# Altium project Guppy Buddy Rev B.PrjPCB (part 9 of 9)

## Sheet FPGA Cart.SchDoc: Cart
size Tabloid; ApprovedBy: NA; CompanyName: Cospan Design LLC; DrawnBy: David McCoy; Engineer: David McCoy; DocumentNumber: 12; Revision: A; SheetNumber: 12; SheetTotal: 18; Client: OSH; Project: Guppy Buddy; ProjectPrettyName: Guppy Buddy
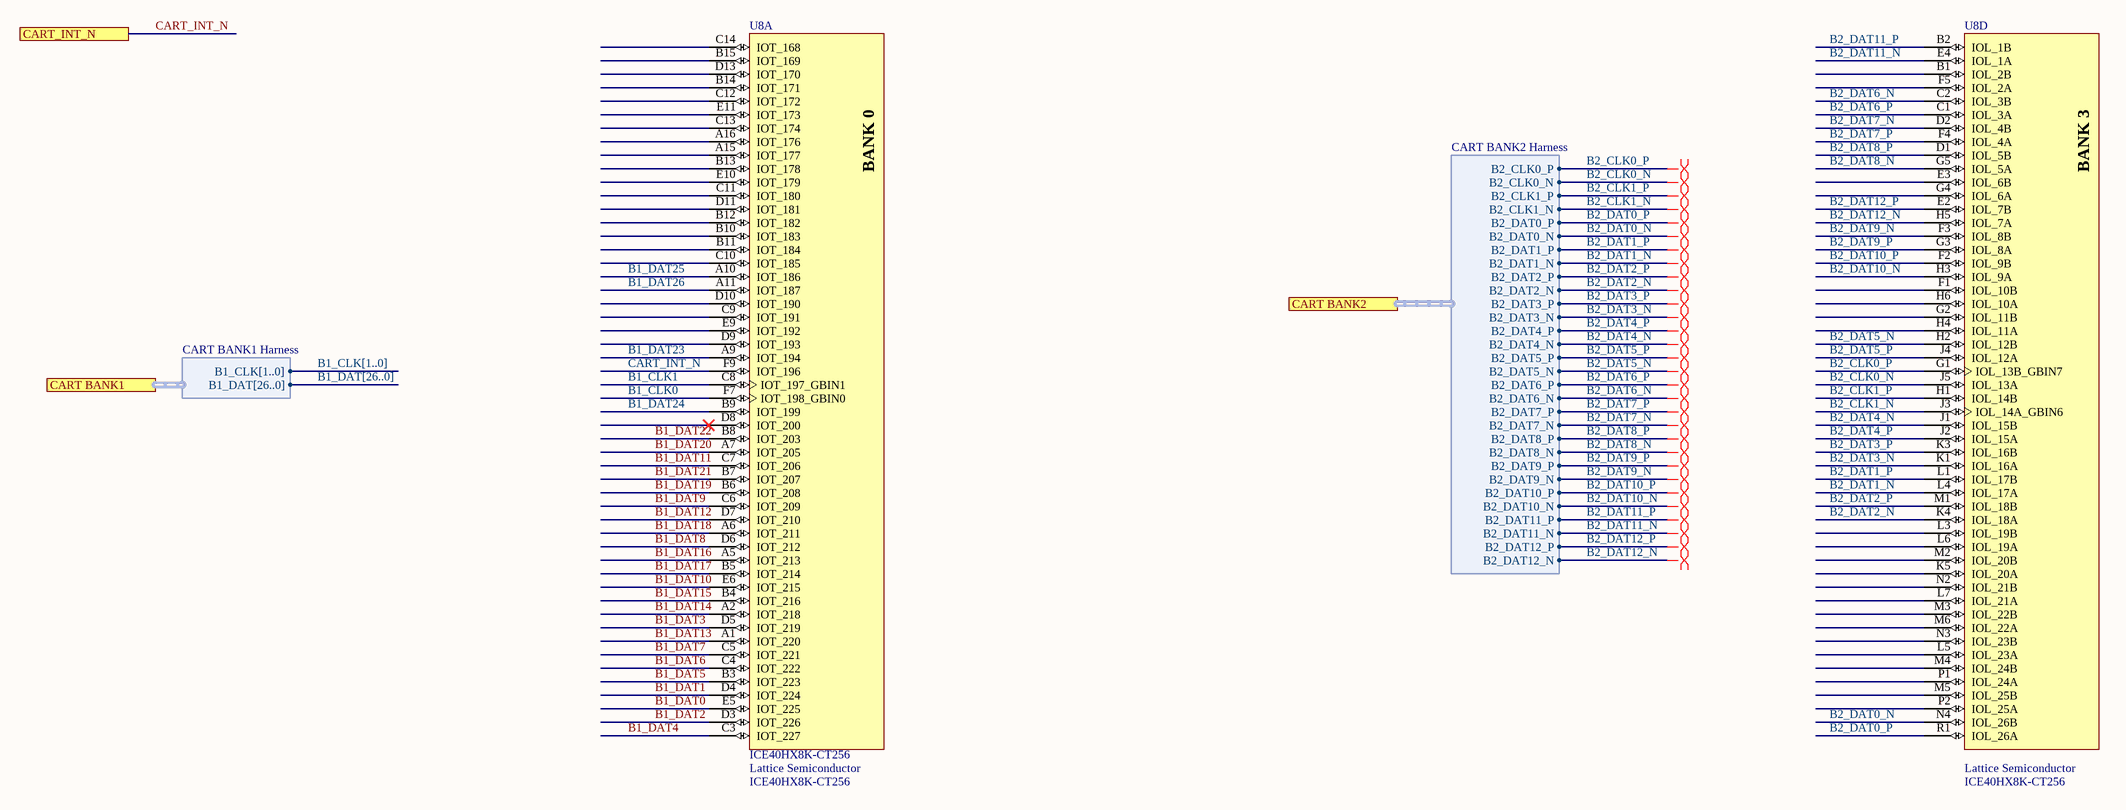
[diagram p17: FPGA Cart.SchDoc]

### Parts
U8  ICE40HX8K-CT256  Manufacturer 1: Lattice Semiconductor  [LATC-caBGA-256]  (parts A,D of 5)

### Ports
CART BANK1 (harness CART BANK1 Harness), CART BANK2 (harness CART BANK2 Harness), CART_INT_N

### Harnesses
CART BANK2 Harness: B2_CLK0_P, B2_CLK0_N, B2_CLK1_P, B2_CLK1_N, B2_DAT0_P, B2_DAT0_N, B2_DAT1_P, B2_DAT1_N, B2_DAT2_P, B2_DAT2_N, B2_DAT3_P, B2_DAT3_N, B2_DAT4_P, B2_DAT4_N, B2_DAT5_P, B2_DAT5_N, B2_DAT6_P, B2_DAT6_N, B2_DAT7_P, B2_DAT7_N, B2_DAT8_P, B2_DAT8_N, B2_DAT9_P, B2_DAT9_N, B2_DAT10_P, B2_DAT10_N, B2_DAT11_P, B2_DAT11_N, B2_DAT12_P, B2_DAT12_N
CART BANK1 Harness: B1_CLK[1..0], B1_DAT[26..0]

### Nets
B1_CLK0: U8.F7(IOT_198_GBIN0)
B1_CLK1: U8.C8(IOT_197_GBIN1)
B1_DAT0: U8.E5(IOT_225)
B1_DAT1: U8.D4(IOT_224)
B1_DAT2: U8.D3(IOT_226)
B1_DAT3: U8.D5(IOT_219)
B1_DAT4: U8.C3(IOT_227)
B1_DAT5: U8.B3(IOT_223)
B1_DAT6: U8.C4(IOT_222)
B1_DAT7: U8.C5(IOT_221)
B1_DAT8: U8.D6(IOT_212)
B1_DAT9: U8.C6(IOT_209)
B1_DAT10: U8.E6(IOT_215)
B1_DAT11: U8.C7(IOT_206)
B1_DAT12: U8.D7(IOT_210)
B1_DAT13: U8.A1(IOT_220)
B1_DAT14: U8.A2(IOT_218)
B1_DAT15: U8.B4(IOT_216)
B1_DAT16: U8.A5(IOT_213)
B1_DAT17: U8.B5(IOT_214)
B1_DAT18: U8.A6(IOT_211)
B1_DAT19: U8.B6(IOT_208)
B1_DAT20: U8.A7(IOT_205)
B1_DAT21: U8.B7(IOT_207)
B1_DAT22: U8.B8(IOT_203)
B1_DAT23: U8.A9(IOT_194)
B1_DAT24: U8.B9(IOT_199)
B1_DAT25: U8.A10(IOT_186)
B1_DAT26: U8.A11(IOT_187)
B2_CLK0_N: U8.J5(IOL_13A) ; port CART BANK2.B2_CLK0_N
B2_CLK0_P: U8.G1(IOL_13B_GBIN7) ; port CART BANK2.B2_CLK0_P
B2_CLK1_N: U8.J3(IOL_14A_GBIN6) ; port CART BANK2.B2_CLK1_N
B2_CLK1_P: U8.H1(IOL_14B) ; port CART BANK2.B2_CLK1_P
B2_DAT0_N: U8.N4(IOL_26B) ; port CART BANK2.B2_DAT0_N
B2_DAT0_P: U8.R1(IOL_26A) ; port CART BANK2.B2_DAT0_P
B2_DAT1_N: U8.L4(IOL_17A) ; port CART BANK2.B2_DAT1_N
B2_DAT1_P: U8.L1(IOL_17B) ; port CART BANK2.B2_DAT1_P
B2_DAT2_N: U8.K4(IOL_18A) ; port CART BANK2.B2_DAT2_N
B2_DAT2_P: U8.M1(IOL_18B) ; port CART BANK2.B2_DAT2_P
B2_DAT3_N: U8.K1(IOL_16A) ; port CART BANK2.B2_DAT3_N
B2_DAT3_P: U8.K3(IOL_16B) ; port CART BANK2.B2_DAT3_P
B2_DAT4_N: U8.J1(IOL_15B) ; port CART BANK2.B2_DAT4_N
B2_DAT4_P: U8.J2(IOL_15A) ; port CART BANK2.B2_DAT4_P
B2_DAT5_N: U8.H2(IOL_12B) ; port CART BANK2.B2_DAT5_N
B2_DAT5_P: U8.J4(IOL_12A) ; port CART BANK2.B2_DAT5_P
B2_DAT6_N: U8.C2(IOL_3B) ; port CART BANK2.B2_DAT6_N
B2_DAT6_P: U8.C1(IOL_3A) ; port CART BANK2.B2_DAT6_P
B2_DAT7_N: U8.D2(IOL_4B) ; port CART BANK2.B2_DAT7_N
B2_DAT7_P: U8.F4(IOL_4A) ; port CART BANK2.B2_DAT7_P
B2_DAT8_N: U8.G5(IOL_5A) ; port CART BANK2.B2_DAT8_N
B2_DAT8_P: U8.D1(IOL_5B) ; port CART BANK2.B2_DAT8_P
B2_DAT9_N: U8.F3(IOL_8B) ; port CART BANK2.B2_DAT9_N
B2_DAT9_P: U8.G3(IOL_8A) ; port CART BANK2.B2_DAT9_P
B2_DAT10_N: U8.H3(IOL_9A) ; port CART BANK2.B2_DAT10_N
B2_DAT10_P: U8.F2(IOL_9B) ; port CART BANK2.B2_DAT10_P
B2_DAT11_N: U8.E4(IOL_1A) ; port CART BANK2.B2_DAT11_N
B2_DAT11_P: U8.B2(IOL_1B) ; port CART BANK2.B2_DAT11_P
B2_DAT12_N: U8.H5(IOL_7A) ; port CART BANK2.B2_DAT12_N
B2_DAT12_P: U8.E2(IOL_7B) ; port CART BANK2.B2_DAT12_P
CART_INT_N: U8.F9(IOT_196) ; port CART_INT_N

Not connected (* = marked no-connect by the designer): U8 A15(IOT_177) A16(IOT_176) B1(IOL_2B) B10(IOT_183) B11(IOT_184) B12(IOT_182) B13(IOT_178) B14(IOT_171) B15(IOT_169) C9(IOT_191) C10(IOT_185) C11(IOT_180) C12(IOT_172) C13(IOT_174) C14(IOT_168) D8(IOT_200)* D9(IOT_193) D10(IOT_190) D11(IOT_181) D13(IOT_170) E3(IOL_6B) E9(IOT_192) E10(IOT_179) E11(IOT_173) F1(IOL_10B) F5(IOL_2A) G2(IOL_11B) G4(IOL_6A) H4(IOL_11A) H6(IOL_10A) K5(IOL_20A) L3(IOL_19B) L5(IOL_23A) L6(IOL_19A) L7(IOL_21A) M2(IOL_20B) M3(IOL_22B) M4(IOL_24B) M5(IOL_25B) M6(IOL_22A) N2(IOL_21B) N3(IOL_23B) P1(IOL_24A) P2(IOL_25A)

### Buses and harness runs
bus B1_CLK[1..0]
bus B1_DAT[26..0]

### Layout directives
differential pair: B2_CLK0_N, B2_CLK0_P, B2_CLK1_N, B2_CLK1_P, B2_DAT0_N, B2_DAT0_P, B2_DAT1_N, B2_DAT1_P, B2_DAT2_N, B2_DAT2_P, B2_DAT3_N, B2_DAT3_P, B2_DAT4_N, B2_DAT4_P, B2_DAT5_N, B2_DAT5_P, B2_DAT6_N, B2_DAT6_P, B2_DAT7_N, B2_DAT7_P, B2_DAT8_N, B2_DAT8_P, B2_DAT9_N, B2_DAT9_P, B2_DAT10_N, B2_DAT10_P, B2_DAT11_N, B2_DAT11_P, B2_DAT12_N, B2_DAT12_P

### Notes on the sheet
- Project:
- http://www.cospandesign.com
- Cospan Design
- Document:
- Engineer:
- Title:
- Client:
- Approved By:
- Revision:
- Date:
- Number:
- of
- (in symbol U_ICE40HX8K-CT256, part A) BANK 0
- (in symbol U_ICE40HX8K-CT256, part D) BANK 3

### Library data of the parts
U8 = U_ICE40HX8K-CT256: iCE40 HX8K Series FPGA Family, 7680 Logic Cells, 1.2 V Core, 128 K Embedded RAM Bits, 256-ball caBGA, Pb-Free, Tray; Supply Voltage: 1.2V; Phase-Locked Loops: 2; Logic Cells: 7680; Embedded RAM Bits: 128K; Description 1: IC FPGA HX 7680LUTS 1.2V 256BGA; Density: 128Kb; Number of Logic Blocks (LABs): 960; Number of I/Os: 206; Min Supply Voltage: 1.14V; Max Supply Voltage: 1.26V; RAM Size: 131072b; Max Frequency: 533MHz; PackageReference: caBGA-256; PackageDescription: 256-Ball Chip Array Ball Grid Array, Body 14 x 14 mm, Pitch 0.8 mm; RoHS: TRUE; Packing: Tray; Mounting Technology: Surface Mount; ComponentLink3URL: http://www.latticesemi.com/lit/docs/package/pkg.pdf; ComponentLink1Description: Manufacturer URL; ComponentLink3Description: Package Specification; Code_JEDEC: MO-275; PackageVersion: Rev. 03.9, 02/2013; ComponentLink1URL: http://www.latticesemi.com/en; ComponentLink2URL: http://www.latticesemi.com/~/media/Documents/DataSheets/iCE/iCE40LPHXFamilyDataSheet.pdf; PartNumber: ICE40HX8K-CT256; Manufacturer: Lattice Semiconductor; ComponentLink2Description: Datasheet; DatasheetVersion: Rev. 02.9; Supplier 1: Digi-Key; Supplier Part Number 1: 220-1575-ND; Stock 1: 549; Pricing 1: 1=11.41, 25=9.898, 100=9.4536 (USD); Case/Package: BGA; Number of Pins: 256; Weight: 0.098203oz; Min Operating Temperature: -40°C; Max Operating Temperature: 85°C; Package Quantity: 119; Packaging: Tray; Operating Supply Voltage: 1.2V; Number of Gates: 7680; Number of Logic Elements/Cells: 7680; Memory Size: 128Kb; Number of Registers: 7680; Length: 14mm; Height: 17mm; Width: 14mm; Lead Free: Lead Free; ComponentLink4URL: http://www.mouser.com/ds/2/225/iCE40FamilyHandbook-311139.pdf; ComponentLink4Description: http://www.mouser.com/ds/2/225/iCE40FamilyHandbook-311139.pdf; Manufacturer Part Number 1: ICE40HX8K-CT256

## Sheet FPGA Config GPMC.SchDoc: Cart
size Tabloid; ApprovedBy: NA; CompanyName: Cospan Design LLC; DrawnBy: David McCoy; Engineer: David McCoy; DocumentNumber: 12; Revision: A; SheetNumber: 12; SheetTotal: 18; Client: OSH; Project: Guppy Buddy; ProjectPrettyName: Guppy Buddy
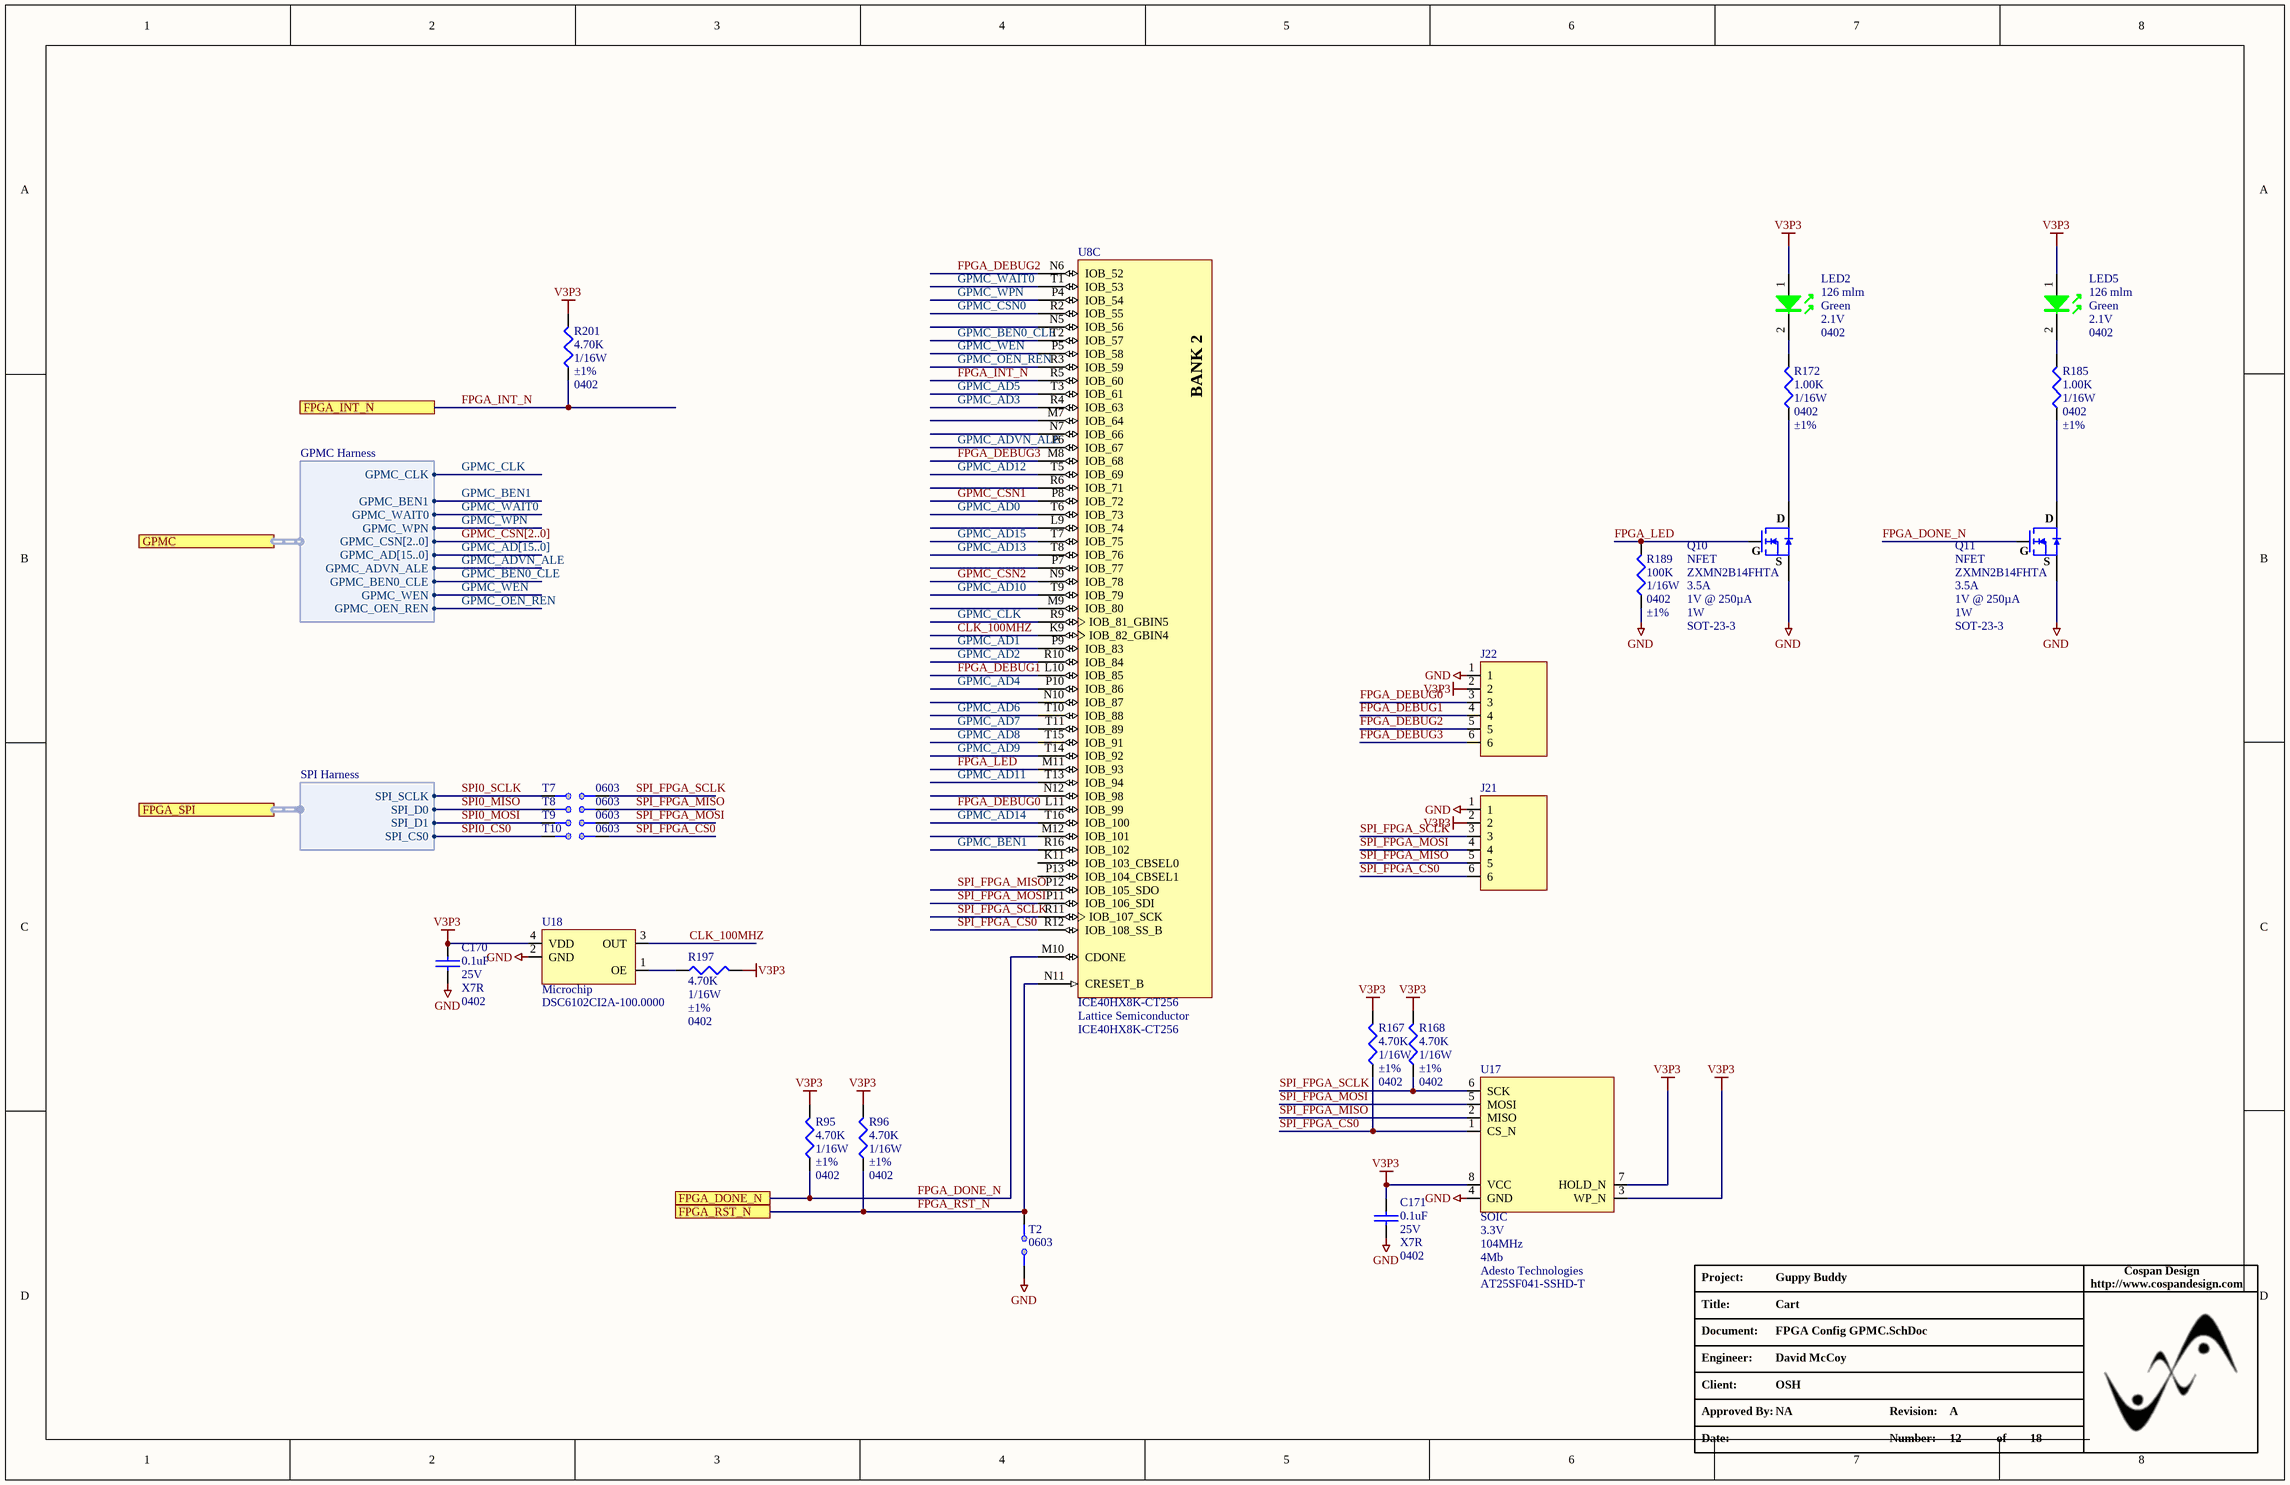
[diagram p18: FPGA Config GPMC.SchDoc]

### Parts
C170  Capacitance: 0.1uF  Voltage - Rated: 25V  Temperature Coefficient: X7R  Package / Case: 0402  [C_0402]  (hidden comment: C_0402_0.1UF_25V)
C171  Capacitance: 0.1uF  Voltage - Rated: 25V  Temperature Coefficient: X7R  Package / Case: 0402  [C_0402]  (hidden comment: C_0402_0.1UF_25V)
J21  J_HDR_1X6_HOLES  [HDR_1X6 _HOLES]  (value not drawn)  (no BOM)
J22  J_HDR_1X6_HOLES  [HDR_1X6 _HOLES]  (value not drawn)  (no BOM)
LED2  Luminous Flux @ Current - Test: 126 mlm  Color: Green  Voltage - Forward (Vf) Typ: 2.1V  Package / Case: 0402  [DIOM1005X07L_GREEN]  (hidden comment: LED_GRN_0402)
LED5  Luminous Flux @ Current - Test: 126 mlm  Color: Green  Voltage - Forward (Vf) Typ: 2.1V  Package / Case: 0402  [DIOM1005X07L_GREEN]  (hidden comment: LED_GRN_0402)
Q10  NFET  Manufacturer Part Number: ZXMN2B14FHTA  Current - Continuous Drain (Id) @ 25° C: 3.5A  Vgs(th) (Max) @ Id: 1V @ 250µA  Power - Max: 1W  Package / Case: SOT-23-3  [SOT-23A]
Q11  NFET  Manufacturer Part Number: ZXMN2B14FHTA  Current - Continuous Drain (Id) @ 25° C: 3.5A  Vgs(th) (Max) @ Id: 1V @ 250µA  Power - Max: 1W  Package / Case: SOT-23-3  [SOT-23A]
R95  Resistance In Ohms: 4.70K  Power (Watts): 1/16W  Tolerance: ±1%  Case: 0402  [R_0402]  (hidden comment: 4.7k Ohms)
R96  Resistance In Ohms: 4.70K  Power (Watts): 1/16W  Tolerance: ±1%  Case: 0402  [R_0402]  (hidden comment: 4.7k Ohms)
R167  Resistance In Ohms: 4.70K  Power (Watts): 1/16W  Tolerance: ±1%  Case: 0402  [R_0402]  (hidden comment: 4.7k Ohms)
R168  Resistance In Ohms: 4.70K  Power (Watts): 1/16W  Tolerance: ±1%  Case: 0402  [R_0402]  (hidden comment: 4.7k Ohms)
R172  Resistance In Ohms: 1.00K  Power (Watts): 1/16W  Case: 0402  Tolerance: ±1%  [R_0402]  (hidden comment: 1.0k Ohms)
R185  Resistance In Ohms: 1.00K  Power (Watts): 1/16W  Case: 0402  Tolerance: ±1%  [R_0402]  (hidden comment: 1.0k Ohms)
R189  Resistance In Ohms: 100K  Power (Watts): 1/16W  Case: 0402  Tolerance: ±1%  [R_0402]  (hidden comment: R_0402_100.0K)
R197  Resistance In Ohms: 4.70K  Power (Watts): 1/16W  Tolerance: ±1%  Case: 0402  [R_0402]  (hidden comment: 4.7k Ohms)
R201  Resistance In Ohms: 4.70K  Power (Watts): 1/16W  Tolerance: ±1%  Case: 0402  [R_0402]  (hidden comment: 4.7k Ohms)
T2  Case: 0603  [ERA-0603-SOLDER_JUMPER]  (hidden comment: Place Solder Bridge to Enable)  (no BOM)
T7  Case: 0603  [ERA-0603-SOLDER_JUMPER]  (hidden comment: Place Solder Bridge to Enable)  (no BOM)
T8  Case: 0603  [ERA-0603-SOLDER_JUMPER]  (hidden comment: Place Solder Bridge to Enable)  (no BOM)
T9  Case: 0603  [ERA-0603-SOLDER_JUMPER]  (hidden comment: Place Solder Bridge to Enable)  (no BOM)
T10  Case: 0603  [ERA-0603-SOLDER_JUMPER]  (hidden comment: Place Solder Bridge to Enable)  (no BOM)
U8  ICE40HX8K-CT256  Manufacturer 1: Lattice Semiconductor  [LATC-caBGA-256]  (part C of 5)
U17  Case/Package: SOIC  Operating Supply Voltage: 3.3V  Max Frequency: 104MHz  Density: 4Mb  Manufacturer 1: Adesto Technologies  Manufacturer Part Number 1: AT25SF041-SSHD-T  [SOIC-8]  (hidden comment: U_AT25SF041-SSHD-T)
U18  Manufacturer 1: Microchip  Manufacturer Part Number 1: DSC6102CI2A-100.0000  [4-SMD OSC]  (hidden comment: U_DSC6102CI2A-100.0000)

### Ports
FPGA_DONE_N, FPGA_INT_N, FPGA_RST_N, FPGA_SPI (harness SPI Harness), GPMC (harness GPMC Harness)

### Harnesses
GPMC Harness: GPMC_CLK, GPMC_BEN1, GPMC_WAIT0, GPMC_WPN, GPMC_CSN[2..0], GPMC_AD[15..0], GPMC_ADVN_ALE, GPMC_BEN0_CLE, GPMC_WEN, GPMC_OEN_REN
SPI Harness: SPI_SCLK, SPI_D0, SPI_D1, SPI_CS0

### Nets
GND: C170.1 C171.1 J21.1 J22.1 Q10.2(S) Q11.2(S) R189.2 T2.2 U17.4(GND) U18.2(GND)
V3P3: C170.2 C171.2 J21.2 J22.2 LED2.1 LED5.1 R95.1 R96.1 R167.1 R168.1 R197.1 R201.1 U17.3(WP_N) U17.7(HOLD_N) U17.8(VCC) U18.4(VDD)
CLK_100MHZ: U8.K9(IOB_82_GBIN4) U18.3(OUT)
FPGA_DEBUG0: J22.3 U8.L11(IOB_99)
FPGA_DEBUG1: J22.4 U8.L10(IOB_85)
FPGA_DEBUG2: J22.5 U8.N6(IOB_52)
FPGA_DEBUG3: J22.6 U8.M8(IOB_68)
FPGA_DONE_N: Q11.1(G) R95.2 U8.M10(CDONE) ; port FPGA_DONE_N
FPGA_INT_N: R201.2 U8.R5(IOB_60) ; port FPGA_INT_N
FPGA_LED: Q10.1(G) R189.1 U8.M11(IOB_93)
FPGA_RST_N: R96.2 T2.1 U8.N11(CRESET_B) ; port FPGA_RST_N
GPMC_AD0: U8.T6(IOB_73)
GPMC_AD1: U8.P9(IOB_83)
GPMC_AD2: U8.R10(IOB_84)
GPMC_AD3: U8.R4(IOB_63)
GPMC_AD4: U8.P10(IOB_86)
GPMC_AD5: U8.T3(IOB_61)
GPMC_AD6: U8.T10(IOB_88)
GPMC_AD7: U8.T11(IOB_89)
GPMC_AD8: U8.T15(IOB_91)
GPMC_AD9: U8.T14(IOB_92)
GPMC_AD10: U8.T9(IOB_79)
GPMC_AD11: U8.T13(IOB_94)
GPMC_AD12: U8.T5(IOB_69)
GPMC_AD13: U8.T8(IOB_76)
GPMC_AD14: U8.T16(IOB_100)
GPMC_AD15: U8.T7(IOB_75)
GPMC_ADVN_ALE: U8.P6(IOB_67) ; port GPMC.GPMC_ADVN_ALE
GPMC_BEN0_CLE: U8.T2(IOB_57) ; port GPMC.GPMC_BEN0_CLE
GPMC_BEN1: U8.R16(IOB_102) ; port GPMC.GPMC_BEN1
GPMC_CLK: U8.R9(IOB_81_GBIN5) ; port GPMC.GPMC_CLK
GPMC_CSN0: U8.R2(IOB_55)
GPMC_CSN1: U8.P8(IOB_72)
GPMC_CSN2: U8.N9(IOB_78)
GPMC_OEN_REN: U8.R3(IOB_59) ; port GPMC.GPMC_OEN_REN
GPMC_WAIT0: U8.T1(IOB_53) ; port GPMC.GPMC_WAIT0
GPMC_WEN: U8.P5(IOB_58) ; port GPMC.GPMC_WEN
GPMC_WPN: U8.P4(IOB_54) ; port GPMC.GPMC_WPN
SPI0_CS0: T10.1 ; port FPGA_SPI.SPI_CS0
SPI0_MISO: T8.1 ; port FPGA_SPI.SPI_D0
SPI0_MOSI: T9.1 ; port FPGA_SPI.SPI_D1
SPI0_SCLK: T7.1 ; port FPGA_SPI.SPI_SCLK
SPI_FPGA_CS0: J21.6 R167.2 T10.2 U8.R12(IOB_108_SS_B) U17.1(CS_N)
SPI_FPGA_MISO: J21.5 T8.2 U8.P12(IOB_105_SDO) U17.2(MISO)
SPI_FPGA_MOSI: J21.4 T9.2 U8.P11(IOB_106_SDI) U17.5(MOSI)
SPI_FPGA_SCLK: J21.3 R168.2 T7.2 U8.R11(IOB_107_SCK) U17.6(SCK)
NetLED2_2: LED2.2 R172.1
NetLED5_2: LED5.2 R185.1
NetQ10_3: Q10.3(D) R172.2
NetQ11_3: Q11.3(D) R185.2
NetR197_2: R197.2 U18.1(OE)

Not connected (* = marked no-connect by the designer): U8 K11(IOB_103_CBSEL0) L9(IOB_74) M7(IOB_64) M9(IOB_80) M12(IOB_101) N5(IOB_56) N7(IOB_66) N10(IOB_87) N12(IOB_98) P7(IOB_77) P13(IOB_104_CBSEL1) R6(IOB_71)

### Buses and harness runs
bus GPMC_AD[15..0]
bus GPMC_CSN[2..0]

### Notes on the sheet
- Project:
- http://www.cospandesign.com
- Cospan Design
- Document:
- Engineer:
- Title:
- Client:
- Approved By:
- Revision:
- Date:
- Number:
- of
- (in symbol U_ICE40HX8K-CT256, part C) BANK 2

### Library data of the parts
C170 C171 = C_0402_0.1UF_25V: CAP CER 0.1UF 25V X6S 0402; Manufacturer 1: Yageo; Manufacturer Part Number 1: CC0402KRX7R8BB104; Description 1: Cap Ceramic 0.1uF 25V X7R 10% SMD 0402 125C Paper T/R; Tolerance: 10%; Dissipation Factor: 3.5%; ComponentLink1URL: https://product.tdk.com/info/en/catalog/datasheets/mlcc_commercial_general_en.pdf; ComponentLink1Description: https://product.tdk.com/info/en/catalog/datasheets/mlcc_commercial_general_en.pdf; Supplier 1: Digi-Key; Supplier Part Number 1: 311-2077-1-ND; Stock 1: 0; Pricing 1: 1=0.1, 10=0.048, 100=0.0215, 500=0.01534, 1000=0.01205, 2500=0.01095, 5000=0.01007 (USD); Mount: Surface Mount; Case/Package: 0402; Case Code (Imperial): 0402; Case Code (Metric): 1005; Min Operating Temperature: -55°C; Max Operating Temperature: 125°C; Voltage Rating: 25V; Voltage Rating (DC): 25V; Packaging: Tape and Reel; Dielectric: X7R; Termination: SMD/SMT; Composition: Ceramic; Length: 1mm; Height: 0.5mm; Width: 0.02inch; Thickness: 0.022inch; Depth: 0.5mm; Radiation Hardening: No; Lead Free: Lead Free; Halogen Free: Halogen Free; ComponentLink2URL: https://datasheet.ciiva.com/11464/upy-gphc-x7r-6-3v-to-50v-8-11464889.pdf; ComponentLink2Description: https://datasheet.ciiva.com/11464/upy-gphc-x7r-6-3v-to-50v-8-11464889.pdf; ComponentLink3URL: https://datasheet.ciiva.com/13210/upy-gphc-x7r-6-3v-to-50v-8-12304-13210908.pdf; ComponentLink3Description: https://datasheet.ciiva.com/13210/upy-gphc-x7r-6-3v-to-50v-8-12304-13210908.pdf; ComponentLink4URL: https://datasheet.ciiva.com/17437/upy-gphc-x7r-6-3v-to-50v-8-17437357.pdf; ComponentLink4Description: https://datasheet.ciiva.com/17437/upy-gphc-x7r-6-3v-to-50v-8-17437357.pdf
J21 J22 = J_HDR_1X6_HOLES: 6 Holes
LED2 LED5 = LED_GRN_0402: LED 1X0.5MM 570NM GN WTR CLR SMD; Manufacturer: Kingbright Corp; Manufacturer Part Number: APHHS1005CGCK; Current - Test: 20mA; Wavelength - Peak: 574nm; Millicandela Rating: 40mcd; Lens Type: Clear; Lens Style/Size: Rectangle, 0.8mm x 0.5mm; Viewing Angle: 120°; Supplier 1: Digi-Key; Supplier Part Number 1: 754-1101-1-ND; RoHS: RoHS Compliant; Category: Optoelectronics; Stock 1: 3400; Pricing: 1=0.24, 10=0.176, 25=0.1412, 100=0.1293, 250=0.11752, 500=0.10576, 1000=0.094 (USD); Wavelength - Dominant: 570nm; Mounting Type: Surface Mount; Packaging: Cut Tape (CT); Size / Dimension: *; Height: *; ComponentLink1URL: http://www.us.kingbright.com/images/catalog/SPEC/APHHS1005CGCK.pdf; ComponentLink1Description: http://www.us.kingbright.com/images/catalog/SPEC/APHHS1005CGCK.pdf
Q10 Q11 = Q_NFET_3.50A_SOT23: MOSFET N-CH 20V 3.5A SOT23-3; Manufacturer: Diodes Incorporated; FET Type: N-Channel; Rds On (Max) @ Id, Vgs: 55 mOhm @ 3.5A, 4.5V; Current - Continuous Drain (Id) @ 25°C: 3.5A (Ta); Drive Voltage (Max Rds On,  Min Rds On): 1.8V, 4.5V; Gate Charge (Qg) (Max) @ Vgs: 11nC @ 4.5V; Input Capacitance (Ciss) (Max) @ Vds: 872pF @ 10V; Vgs (Max): ±8V; Power Dissipation (Max): 1W (Ta); Supplier 1: Digi-Key; Supplier Part Number 1: ZXMN2B14FHCT-ND; RoHS: RoHS Compliant; Category: Discrete Semiconductor Products; Stock 1: 1379; FET Feature: -; Drain to Source Voltage (Vdss): 20V; Mounting Type: Surface Mount; Supplier Device Package: SOT-23-3; Packaging: Cut Tape (CT); ComponentLink1URL: http://www.diodes.com/_files/datasheets/ZXMN2B14FH.pdf; ComponentLink1Description: http://www.diodes.com/_files/datasheets/ZXMN2B14FH.pdf; Pricing 1: 1=0.78, 10=0.683, 100=0.5238, 500=0.41406, 1000=0.33125 (USD); Part Status: Active; Technology: MOSFET (Metal Oxide); Operating Temperature: -55°C ~ 150°C (TJ)
R95 R96 R167 R168 R197 R201 = R_0402_4.70K: RES 4.70K OHM 1/16W 1% 0402 SMD; Manufacturer: Yageo; Manufacturer Part Number: RC0402FR-074K7L; Temperature Coefficient: ±100ppm/°C; Supplier 1: Digi-Key; Supplier Part Number 1: 311-4.7KLRCT-ND; RoHS: RoHS Compliant; Category: Resistors; Stock 1: 3610; Pricing: 10=0.014, 100=0.0063, 500=0.00382, 1000=0.0027, 5000=0.00203 (USD); Resistance (Ohms): 4.7K; Composition: Thick Film; Features: -; Package / Case: 0402 (1005 Metric); Size / Dimension: 0.039" L x 0.020" W (1.00mm x 0.50mm); Height: 0.016" (0.40mm); Number of Terminations: 2; Packaging: Cut Tape (CT); ComponentLink1URL: http://www.yageo.com/documents/recent/PYu-RC0402_51_RoHS_L_6.pdf; ComponentLink1Description: http://www.yageo.com/documents/recent/PYu-RC0402_51_RoHS_L_6.pdf
R172 R185 = R_0402_1.0K: RES 1.00K OHM 1/16W 1% 0402 SMD; Manufacturer: Yageo; Manufacturer Part Number: RC0402FR-071KL; Resistance (Ohms): 1K; Temperature Coefficient: ±100ppm/°C; Supplier 1: Digi-Key; Supplier Part Number 1: 311-1.00KLRCT-ND; RoHS: RoHS Compliant; Category: Resistors; Stock 1: 2103351; Pricing: 10=0.014, 100=0.0063, 500=0.00382, 1000=0.0027, 5000=0.00203 (USD); Composition: Thick Film; Features: -; Package / Case: 0402 (1005 Metric); Size / Dimension: 0.039" L x 0.020" W (1.00mm x 0.50mm); Height: 0.016" (0.40mm); Number of Terminations: 2; Packaging: Cut Tape (CT); ComponentLink1URL: http://www.yageo.com/documents/recent/PYu-RC0402_51_RoHS_L_6.pdf; ComponentLink1Description: http://www.yageo.com/documents/recent/PYu-RC0402_51_RoHS_L_6.pdf
R189 = R_0402_100.0K: RES 100K OHM 1/16W 1% 0402 SMD; Manufacturer: Stackpole Electronics Inc; Manufacturer Part Number: RMCF0402FT100K; Temperature Coefficient: ±100ppm/°C; RoHS: RoHS Compliant; Category: Resistors; Composition: Thick Film; Features: -; Lead Style: Surface Mount (SMD - SMT); Packaging: Cut Tape (CT); Resistance (Ohms): 100k; Package / Case: 0402 (1005 Metric); Supplier Device Package: 0402; Size / Dimension: 0.039" L x 0.020" W (1.00mm x 0.50mm); Height: 0.016" (0.40mm); Number of Terminations: 2; Supplier 1: Digi-Key; Supplier Part Number 1: RMCF0402FT100KCT-ND; Stock 1: 18746; Pricing: 1=0.04, 10=0.025, 50=0.0138, 100=0.0105, 250=0.0078, 500=0.00576, 1000=0.00384, 2500=0.00324, 5000=0.0027 (USD); ComponentLink1URL: http://www.seielect.com/Catalog/SEI-RMCF_RMCP.pdf; ComponentLink1Description: http://www.seielect.com/Catalog/SEI-RMCF_RMCP.pdf
T2 T7-T10 = T_0603_JUMPER_PAD: SOLDER_JUMPER PAD
U8 = U_ICE40HX8K-CT256: as U8 on sheet FPGA Cart; PackageReference: caBGA-256; PackageDescription: 256-Ball Chip Array Ball Grid Array, Body 14 x 14 mm, Pitch 0.8 mm; RoHS: TRUE; Packing: Tray; Mounting Technology: Surface Mount; ComponentLink3URL: http://www.latticesemi.com/lit/docs/package/pkg.pdf; ComponentLink1Description: Manufacturer URL; ComponentLink3Description: Package Specification; Code_JEDEC: MO-275; PackageVersion: Rev. 03.9, 02/2013; ComponentLink1URL: http://www.latticesemi.com/en; ComponentLink2URL: http://www.latticesemi.com/~/media/Documents/DataSheets/iCE/iCE40LPHXFamilyDataSheet.pdf; PartNumber: ICE40HX8K-CT256; Manufacturer: Lattice Semiconductor; ComponentLink2Description: Datasheet; DatasheetVersion: Rev. 02.9; Supplier 1: Digi-Key; Supplier Part Number 1: 220-1575-ND; Stock 1: 549; Pricing 1: 1=11.41, 25=9.898, 100=9.4536 (USD); Case/Package: BGA; Number of Pins: 256; Weight: 0.098203oz; Min Operating Temperature: -40°C; Max Operating Temperature: 85°C; Package Quantity: 119; Packaging: Tray; Operating Supply Voltage: 1.2V; Number of Gates: 7680; Number of Logic Elements/Cells: 7680; Memory Size: 128Kb; Number of Registers: 7680; Length: 14mm; Height: 17mm; Width: 14mm; Lead Free: Lead Free; ComponentLink4URL: http://www.mouser.com/ds/2/225/iCE40FamilyHandbook-311139.pdf; ComponentLink4Description: http://www.mouser.com/ds/2/225/iCE40FamilyHandbook-311139.pdf; Manufacturer Part Number 1: ICE40HX8K-CT256
U17 = U_AT25SF041-SSHD-T: Flash Mem Serial-SPI 3.3V 4Mbit 4M x 1bit 8-Pin SOIC T/R; Interface: Serial,SPI; Page Size: 256B; Max Supply Voltage: 3.6V; Min Supply Voltage: 2.5V; Memory Type: FLASH,NOR; Max Supply Current: 8mA; Data Bus Width: 8b; Access Time: 8ns; Description 1: Flash Mem Serial-SPI 3.3V 4Mbit 4M x 1bit 8-Pin SOIC T/R; Stock 1: 106462; Mount: Surface Mount; Number of Pins: 8; Weight: 0.019048oz; Contact Plating: Gold; Min Operating Temperature: -40°C; Max Operating Temperature: 85°C; Packaging: Tape and Reel; Frequency: 104MHz; Memory Size: 4Mb; Package Quantity: 4000; Lead Free: Lead Free; Supplier 1: Digi-Key; Supplier Part Number 1: 1265-1131-6-ND; Pricing 1: 1=0.36 (USD)
U18 = U_DSC6102CI2A-100.0000: OSC MEMS 100.0000MHZ CMOS SMD; Description 1: OSC MEMS 100.0000MHZ CMOS SMD; Stock 1: 719; Supplier 1: Digi-Key; Supplier Part Number 1: DSC6102CI2A-100.0000-ND; Pricing 1: 1=0.92, 25=0.7624, 100=0.7339 (USD)

## Sheet FPGA SDRAM.SchDoc: Cart
size Tabloid; ApprovedBy: NA; CompanyName: Cospan Design LLC; DrawnBy: David McCoy; Engineer: David McCoy; DocumentNumber: 12; Revision: A; SheetNumber: 12; SheetTotal: 18; Client: OSH; Project: Guppy Buddy; ProjectPrettyName: Guppy Buddy
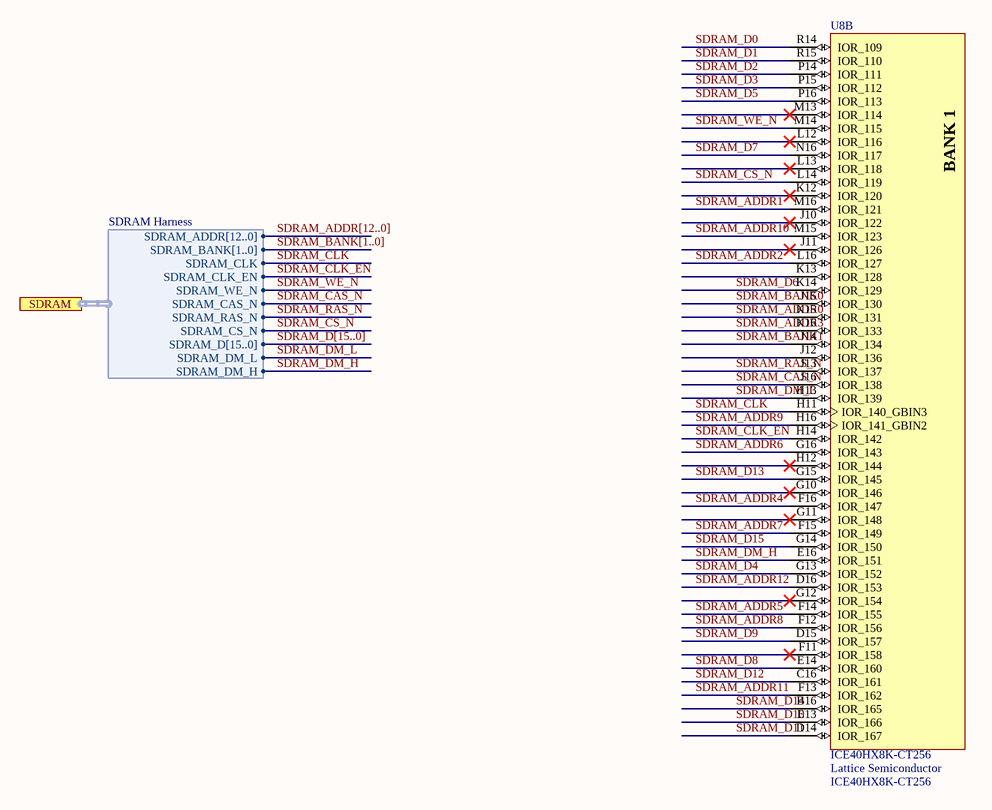
[diagram p19: FPGA SDRAM.SchDoc]

### Parts
U8  ICE40HX8K-CT256  Manufacturer 1: Lattice Semiconductor  [LATC-caBGA-256]  (part B of 5)

### Ports
SDRAM (harness SDRAM Harness)

### Harnesses
SDRAM Harness: SDRAM_ADDR[12..0], SDRAM_BANK[1..0], SDRAM_CLK, SDRAM_CLK_EN, SDRAM_WE_N, SDRAM_CAS_N, SDRAM_RAS_N, SDRAM_CS_N, SDRAM_D[15..0], SDRAM_DM_L, SDRAM_DM_H

### Nets
SDRAM_ADDR0: U8.K15(IOR_131)
SDRAM_ADDR1: U8.M16(IOR_121)
SDRAM_ADDR2: U8.L16(IOR_127)
SDRAM_ADDR3: U8.K16(IOR_133)
SDRAM_ADDR4: U8.F16(IOR_147)
SDRAM_ADDR5: U8.F14(IOR_155)
SDRAM_ADDR6: U8.G16(IOR_143)
SDRAM_ADDR7: U8.F15(IOR_149)
SDRAM_ADDR8: U8.F12(IOR_156)
SDRAM_ADDR9: U8.H16(IOR_141_GBIN2)
SDRAM_ADDR10: U8.M15(IOR_123)
SDRAM_ADDR11: U8.F13(IOR_162)
SDRAM_ADDR12: U8.D16(IOR_153)
SDRAM_BANK0: U8.J15(IOR_130)
SDRAM_BANK1: U8.J14(IOR_134)
SDRAM_CAS_N: U8.J16(IOR_138) ; port SDRAM.SDRAM_CAS_N
SDRAM_CLK: U8.H11(IOR_140_GBIN3) ; port SDRAM.SDRAM_CLK
SDRAM_CLK_EN: U8.H14(IOR_142) ; port SDRAM.SDRAM_CLK_EN
SDRAM_CS_N: U8.L14(IOR_119) ; port SDRAM.SDRAM_CS_N
SDRAM_D0: U8.R14(IOR_109)
SDRAM_D1: U8.R15(IOR_110)
SDRAM_D2: U8.P14(IOR_111)
SDRAM_D3: U8.P15(IOR_112)
SDRAM_D4: U8.G13(IOR_152)
SDRAM_D5: U8.P16(IOR_113)
SDRAM_D6: U8.K14(IOR_129)
SDRAM_D7: U8.N16(IOR_117)
SDRAM_D8: U8.E14(IOR_160)
SDRAM_D9: U8.D15(IOR_157)
SDRAM_D10: U8.E13(IOR_166)
SDRAM_D11: U8.D14(IOR_167)
SDRAM_D12: U8.C16(IOR_161)
SDRAM_D13: U8.G15(IOR_145)
SDRAM_D14: U8.B16(IOR_165)
SDRAM_D15: U8.G14(IOR_150)
SDRAM_DM_H: U8.E16(IOR_151) ; port SDRAM.SDRAM_DM_H
SDRAM_DM_L: U8.H13(IOR_139) ; port SDRAM.SDRAM_DM_L
SDRAM_RAS_N: U8.J13(IOR_137) ; port SDRAM.SDRAM_RAS_N
SDRAM_WE_N: U8.M14(IOR_115) ; port SDRAM.SDRAM_WE_N

Not connected (* = marked no-connect by the designer): U8 F11(IOR_158)* G10(IOR_146)* G11(IOR_148)* G12(IOR_154)* H12(IOR_144)* J10(IOR_122)* J11(IOR_126)* J12(IOR_136) K12(IOR_120)* K13(IOR_128) L12(IOR_116)* L13(IOR_118)* M13(IOR_114)*

### Buses and harness runs
bus SDRAM_ADDR[12..0]
bus SDRAM_BANK[1..0]
bus SDRAM_D[15..0]

### Notes on the sheet
- Project:
- http://www.cospandesign.com
- Cospan Design
- Document:
- Engineer:
- Title:
- Client:
- Approved By:
- Revision:
- Date:
- Number:
- of
- (in symbol U_ICE40HX8K-CT256, part B) BANK 1

### Library data of the parts
U8 = U_ICE40HX8K-CT256: as U8 on sheet FPGA Cart; PackageReference: caBGA-256; PackageDescription: 256-Ball Chip Array Ball Grid Array, Body 14 x 14 mm, Pitch 0.8 mm; RoHS: TRUE; Packing: Tray; Mounting Technology: Surface Mount; ComponentLink3URL: http://www.latticesemi.com/lit/docs/package/pkg.pdf; ComponentLink1Description: Manufacturer URL; ComponentLink3Description: Package Specification; Code_JEDEC: MO-275; PackageVersion: Rev. 03.9, 02/2013; ComponentLink1URL: http://www.latticesemi.com/en; ComponentLink2URL: http://www.latticesemi.com/~/media/Documents/DataSheets/iCE/iCE40LPHXFamilyDataSheet.pdf; PartNumber: ICE40HX8K-CT256; Manufacturer: Lattice Semiconductor; ComponentLink2Description: Datasheet; DatasheetVersion: Rev. 02.9; Supplier 1: Digi-Key; Supplier Part Number 1: 220-1575-ND; Stock 1: 549; Pricing 1: 1=11.41, 25=9.898, 100=9.4536 (USD); Case/Package: BGA; Number of Pins: 256; Weight: 0.098203oz; Min Operating Temperature: -40°C; Max Operating Temperature: 85°C; Package Quantity: 119; Packaging: Tray; Operating Supply Voltage: 1.2V; Number of Gates: 7680; Number of Logic Elements/Cells: 7680; Memory Size: 128Kb; Number of Registers: 7680; Length: 14mm; Height: 17mm; Width: 14mm; Lead Free: Lead Free; ComponentLink4URL: http://www.mouser.com/ds/2/225/iCE40FamilyHandbook-311139.pdf; ComponentLink4Description: http://www.mouser.com/ds/2/225/iCE40FamilyHandbook-311139.pdf; Manufacturer Part Number 1: ICE40HX8K-CT256

## Sheet SDRAM.SchDoc
size Tabloid; ApprovedBy: NA
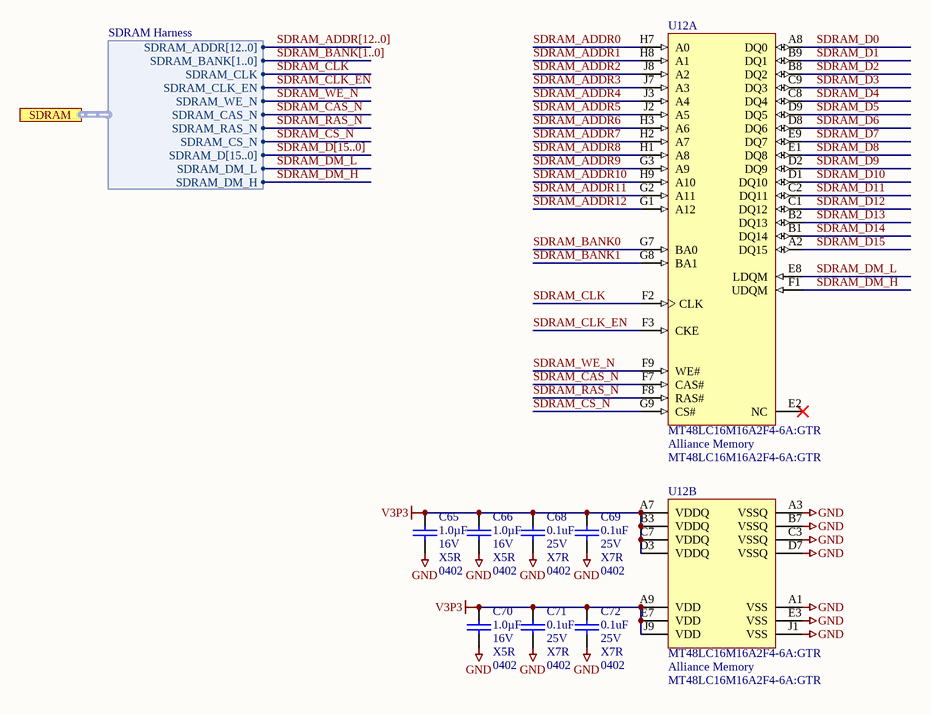
[diagram p20: SDRAM.SchDoc]

### Parts
C65  Capacitance: 1.0µF  Voltage - Rated: 16V  Temperature Coefficient: X5R  Package / Case: 0402  [C_0402]  (hidden comment: 1.0uF)
C66  Capacitance: 1.0µF  Voltage - Rated: 16V  Temperature Coefficient: X5R  Package / Case: 0402  [C_0402]  (hidden comment: 1.0uF)
C68  Capacitance: 0.1uF  Voltage - Rated: 25V  Temperature Coefficient: X7R  Package / Case: 0402  [C_0402]  (hidden comment: C_0402_0.1UF_25V)
C69  Capacitance: 0.1uF  Voltage - Rated: 25V  Temperature Coefficient: X7R  Package / Case: 0402  [C_0402]  (hidden comment: C_0402_0.1UF_25V)
C70  Capacitance: 1.0µF  Voltage - Rated: 16V  Temperature Coefficient: X5R  Package / Case: 0402  [C_0402]  (hidden comment: 1.0uF)
C71  Capacitance: 0.1uF  Voltage - Rated: 25V  Temperature Coefficient: X7R  Package / Case: 0402  [C_0402]  (hidden comment: C_0402_0.1UF_25V)
C72  Capacitance: 0.1uF  Voltage - Rated: 25V  Temperature Coefficient: X7R  Package / Case: 0402  [C_0402]  (hidden comment: C_0402_0.1UF_25V)
U12  MT48LC16M16A2F4-6A:GTR  Manufacturer 1: Alliance Memory  [MICT-B4-54]  (parts A,B of 2)

### Ports
SDRAM (harness SDRAM Harness)

### Harnesses
SDRAM Harness: SDRAM_ADDR[12..0], SDRAM_BANK[1..0], SDRAM_CLK, SDRAM_CLK_EN, SDRAM_WE_N, SDRAM_CAS_N, SDRAM_RAS_N, SDRAM_CS_N, SDRAM_D[15..0], SDRAM_DM_L, SDRAM_DM_H

### Nets
GND: C65.1 C66.1 C68.1 C69.1 C70.1 C71.1 C72.1 U12.A1(VSS) U12.A3(VSSQ) U12.B7(VSSQ) U12.C3(VSSQ) U12.D7(VSSQ) U12.E3(VSS) U12.J1(VSS)
V3P3: C65.2 C66.2 C68.2 C69.2 C70.2 C71.2 C72.2 U12.A7(VDDQ) U12.A9(VDD) U12.B3(VDDQ) U12.C7(VDDQ) U12.D3(VDDQ) U12.E7(VDD) U12.J9(VDD)
SDRAM_ADDR0: U12.H7(A0)
SDRAM_ADDR1: U12.H8(A1)
SDRAM_ADDR2: U12.J8(A2)
SDRAM_ADDR3: U12.J7(A3)
SDRAM_ADDR4: U12.J3(A4)
SDRAM_ADDR5: U12.J2(A5)
SDRAM_ADDR6: U12.H3(A6)
SDRAM_ADDR7: U12.H2(A7)
SDRAM_ADDR8: U12.H1(A8)
SDRAM_ADDR9: U12.G3(A9)
SDRAM_ADDR10: U12.H9(A10)
SDRAM_ADDR11: U12.G2(A11)
SDRAM_ADDR12: U12.G1(A12)
SDRAM_BANK0: U12.G7(BA0)
SDRAM_BANK1: U12.G8(BA1)
SDRAM_CAS_N: U12.F7(CAS#) ; port SDRAM.SDRAM_CAS_N
SDRAM_CLK: U12.F2(CLK) ; port SDRAM.SDRAM_CLK
SDRAM_CLK_EN: U12.F3(CKE) ; port SDRAM.SDRAM_CLK_EN
SDRAM_CS_N: U12.G9(CS#) ; port SDRAM.SDRAM_CS_N
SDRAM_D0: U12.A8(DQ0)
SDRAM_D1: U12.B9(DQ1)
SDRAM_D2: U12.B8(DQ2)
SDRAM_D3: U12.C9(DQ3)
SDRAM_D4: U12.C8(DQ4)
SDRAM_D5: U12.D9(DQ5)
SDRAM_D6: U12.D8(DQ6)
SDRAM_D7: U12.E9(DQ7)
SDRAM_D8: U12.E1(DQ8)
SDRAM_D9: U12.D2(DQ9)
SDRAM_D10: U12.D1(DQ10)
SDRAM_D11: U12.C2(DQ11)
SDRAM_D12: U12.C1(DQ12)
SDRAM_D13: U12.B2(DQ13)
SDRAM_D14: U12.B1(DQ14)
SDRAM_D15: U12.A2(DQ15)
SDRAM_DM_H: U12.F1(UDQM) ; port SDRAM.SDRAM_DM_H
SDRAM_DM_L: U12.E8(LDQM) ; port SDRAM.SDRAM_DM_L
SDRAM_RAS_N: U12.F8(RAS#) ; port SDRAM.SDRAM_RAS_N
SDRAM_WE_N: U12.F9(WE#) ; port SDRAM.SDRAM_WE_N

Not connected (* = marked no-connect by the designer): U12 E2(NC)*

### Buses and harness runs
bus SDRAM_ADDR[12..0]
bus SDRAM_BANK[1..0]
bus SDRAM_D[15..0]

### Notes on the sheet
- Project:
- http://www.cospandesign.com
- Cospan Design
- Document:
- Engineer:
- Title:
- Client:
- Approved By:
- Revision:
- Date:
- Number:
- of

### Library data of the parts
C65 C66 C70 = C_0402_1.0UF_16V: CAP CER 1.0UF 16V X5R 0402; Manufacturer 1: Samsung; Manufacturer Part Number 1: CL05A105KO5NNNC; Description 1: Cap Ceramic 1uF 16V X5R 10% SMD 0402 85C Paper T/R; Tolerance: 10%; ComponentLink1URL: http://ds.yuden.co.jp/TYCOMPAS/ut/detail.do?productNo=EMK105BJ105KV-F&fileName=EMK105BJ105KV-F_SS&mode=specSheetDownload; ComponentLink1Description: http://ds.yuden.co.jp/TYCOMPAS/ut/detail.do?productNo=EMK105BJ105KV-F&fileName=EMK105BJ105KV-F_SS&mode=specSheetDownload; ComponentLink2URL: https://datasheet.ciiva.com/16207/cl05a105ko5nnnc-16207571.pdf; ComponentLink2Description: https://datasheet.ciiva.com/16207/cl05a105ko5nnnc-16207571.pdf; ComponentLink3URL: https://datasheet.ciiva.com/15195/getdatasheetpartid-355272-15195629.pdf; ComponentLink3Description: https://datasheet.ciiva.com/15195/getdatasheetpartid-355272-15195629.pdf; Supplier 1: Digi-Key; Supplier Part Number 1: 1276-1067-6-ND; Stock 1: 26908; Pricing 1: 1=0.1, 10=0.062, 100=0.0276, 500=0.01968, 1000=0.01547, 2500=0.01406, 5000=0.01294 (USD); Mount: Surface Mount; Case/Package: 0402; Case Code (Metric): 1005; Case Code (Imperial): 0402; Contact Plating: Tin; Min Operating Temperature: -55°C; Max Operating Temperature: 85°C; Dielectric: X5R; Packaging: Tape and Reel; Package Quantity: 1; Voltage Rating: 16V; Voltage: 16V; Length: 1mm; Height: 0.5mm; Width: 0.02inch; Thickness: 0.022inch; Depth: 0.5mm; Radiation Hardening: No
C68 C69 C71 C72 = C_0402_0.1UF_25V: as C170 on sheet FPGA Config GPMC; ComponentLink1URL: https://product.tdk.com/info/en/catalog/datasheets/mlcc_commercial_general_en.pdf; ComponentLink1Description: https://product.tdk.com/info/en/catalog/datasheets/mlcc_commercial_general_en.pdf; Supplier 1: Digi-Key; Supplier Part Number 1: 311-2077-1-ND; Stock 1: 0; Pricing 1: 1=0.1, 10=0.048, 100=0.0215, 500=0.01534, 1000=0.01205, 2500=0.01095, 5000=0.01007 (USD); Mount: Surface Mount; Case/Package: 0402; Case Code (Imperial): 0402; Case Code (Metric): 1005; Min Operating Temperature: -55°C; Max Operating Temperature: 125°C; Voltage Rating: 25V; Voltage Rating (DC): 25V; Packaging: Tape and Reel; Dielectric: X7R; Termination: SMD/SMT; Composition: Ceramic; Length: 1mm; Height: 0.5mm; Width: 0.02inch; Thickness: 0.022inch; Depth: 0.5mm; Radiation Hardening: No; Lead Free: Lead Free; Halogen Free: Halogen Free; ComponentLink2URL: https://datasheet.ciiva.com/11464/upy-gphc-x7r-6-3v-to-50v-8-11464889.pdf; ComponentLink2Description: https://datasheet.ciiva.com/11464/upy-gphc-x7r-6-3v-to-50v-8-11464889.pdf; ComponentLink3URL: https://datasheet.ciiva.com/13210/upy-gphc-x7r-6-3v-to-50v-8-12304-13210908.pdf; ComponentLink3Description: https://datasheet.ciiva.com/13210/upy-gphc-x7r-6-3v-to-50v-8-12304-13210908.pdf; ComponentLink4URL: https://datasheet.ciiva.com/17437/upy-gphc-x7r-6-3v-to-50v-8-17437357.pdf; ComponentLink4Description: https://datasheet.ciiva.com/17437/upy-gphc-x7r-6-3v-to-50v-8-17437357.pdf
U12 = U_MT48LC16M16A2F4-6A: 256Mb PC133 SDR SDRAM, 16Mb x 16, 6ns, 3.3V, 0 to 70 degC, 54-Ball VFBGA, Pb-Free; Description 1: IC SDRAM 256MBIT 6NS 54VFBGA; ComponentLink1URL: http://www.micron.com/; ComponentLink1Description: Manufacturer URL; ComponentLink2URL: http://www.micron.com/~/media/Documents/Products/Data%20Sheet/DRAM/256Mb_sdr.pdf; ComponentLink2Description: Datasheet; ComponentLink3Description: Package Specification; ComponentLink3URL: http://www.micron.com/~/media/Documents/Products/Data%20Sheet/DRAM/128Mbx16x32Mobile.pdf; Supplier 1: Digi-Key; Supplier Part Number 1: 1450-1350-6-ND; Stock 1: 3138; Pricing 1: 1=3.29, 10=2.955, 25=2.908, 50=2.9002, 100=2.5915, 250=2.50728, 500=2.49792, 1000=2.3264 (USD); Manufacturer Part Number 1: MT48LC16M16A2F4-6A:GTR

## Nets that join several sheets
GND: Block Diagram (J6.8 J8.4 S15.2), Battery Manager (18 pins), USB Type C (31 pins), USB Type C Connector ESD (19 pins), SOM (11 pins), SOM Power (42 pins), SOM Analog USB (R183.2 U2.N13), User Interface (46 pins), WIFI Bluetooth (84 pins), SDCard (C45.1 C46.1 J5.6 J5.9), LCD (22 pins), Cart (18 pins), Audio Codec (23 pins), Power (C31.1 C57.1 C103.1 U10.4), Power Main Regulators (35 pins), Low Speed Expansion (J20.1), FPGA (41 pins), FPGA Config GPMC (10 pins), SDRAM (14 pins)
SYS_ADC_1P8V: SOM Analog USB (C5.2 R62.2 U2.A7), Audio Codec (S2.3)
SYS_VDD1_3P3V: SOM (5 pins), SOM Power (6 pins), SDCard (10 pins)
SYS_VDD3_3P3V: SOM Power (16 pins), Power Main Regulators (R40.1)
USB_3V3: USB Type C (21 pins), USB Type C Connector ESD (C125.2 U30.10)
V1P2: Block Diagram (J6.3), Power (C103.2 U10.5), FPGA (14 pins)
V1P8: Block Diagram (J6.4), User Interface (C85.2 C87.2 J16.2 J17.2), WIFI Bluetooth (13 pins), Audio Codec (C109.2 C110.2 U15.21), Power (C57.2 U10.6)
V3P3: Block Diagram (J6.5 J8.3), USB Type C (C102.2 U14.53), SOM (R56.1 R57.1), SOM Power (R49.1 R50.1), SOM Analog USB (R181.1 R182.1), User Interface (10 pins), WIFI Bluetooth (5 pins), LCD (J11.1 L8.2 R104.1), Cart (6 pins), Audio Codec (7 pins), Power Main Regulators (C140.2 L11.1 R171.1), FPGA (19 pins), FPGA Config GPMC (16 pins), SDRAM (14 pins)
V5P0: Block Diagram (J6.6), SOM Power (U2.P10 U2.R10 U2.T10), SOM Analog USB (U2.M15), LCD (C47.2 C48.2 L7.1 U13.5), Cart (J18.1 J18.2 J18.3 J18.4), Audio Codec (C79.2 C80.2 U15.18), Power (C31.2 U10.1 U10.2 U10.3), Power Main Regulators (C113.2 L10.1 R165.1)
V_USB_HV: Battery Manager (9 pins), USB Type C (C88.2 C89.2 U14.33 U14.34)
VADJ1: Block Diagram (J6.1), Cart (J18.21 J18.23 J18.45 J18.47), Power Main Regulators (C146.2 L12.1 R187.1), FPGA (8 pins)
VADJ2: Block Diagram (J6.2), Cart (J18.22 J18.24 J18.46 J18.48), Power Main Regulators (C152.2 L13.1 R191.1), FPGA (8 pins)
VBUS: USB Type C (L4.1), USB Type C Connector ESD (9 pins)
VSYS: Block Diagram (J6.7), Battery Manager (12 pins), Power Main Regulators (10 pins)
ADC0: SOM Analog USB (U2.A8), User Interface (J16.3)
ADC1: SOM Analog USB (U2.B8), User Interface (J16.1)
ADC2: SOM Analog USB (U2.B6), User Interface (J17.1)
ADC3: SOM Analog USB (U2.C6), User Interface (J17.3)
ALERT: Battery Manager (T19.1 U1.14), User Interface (U5.14)
AUDIO_POWER_DOWN_N: SOM (U2.C13), Audio Codec (U15.8)
B1_CLK0: Cart (J18.29), FPGA Cart (U8.F7)
B1_CLK1: Cart (J18.31), FPGA Cart (U8.C8)
B1_DAT0: Cart (J18.33), FPGA Cart (U8.E5)
B1_DAT1: Cart (J18.35), FPGA Cart (U8.D4)
B1_DAT2: Cart (J18.37), FPGA Cart (U8.D3)
B1_DAT3: Cart (J18.39), FPGA Cart (U8.D5)
B1_DAT4: Cart (J18.49), FPGA Cart (U8.C3)
B1_DAT5: Cart (J18.51), FPGA Cart (U8.B3)
B1_DAT6: Cart (J18.53), FPGA Cart (U8.C4)
B1_DAT7: Cart (J18.55), FPGA Cart (U8.C5)
B1_DAT8: Cart (J18.57), FPGA Cart (U8.D6)
B1_DAT9: Cart (J18.59), FPGA Cart (U8.C6)
B1_DAT10: Cart (J18.61), FPGA Cart (U8.E6)
B1_DAT11: Cart (J18.63), FPGA Cart (U8.C7)
B1_DAT12: Cart (J18.65), FPGA Cart (U8.D7)
B1_DAT13: Cart (J18.67), FPGA Cart (U8.A1)
B1_DAT14: Cart (J18.69), FPGA Cart (U8.A2)
B1_DAT15: Cart (J18.71), FPGA Cart (U8.B4)
B1_DAT16: Cart (J18.73), FPGA Cart (U8.A5)
B1_DAT17: Cart (J18.75), FPGA Cart (U8.B5)
B1_DAT18: Cart (J18.77), FPGA Cart (U8.A6)
B1_DAT19: Cart (J18.79), FPGA Cart (U8.B6)
B1_DAT20: Cart (J18.81), FPGA Cart (U8.A7)
B1_DAT21: Cart (J18.83), FPGA Cart (U8.B7)
B1_DAT22: Cart (J18.85), FPGA Cart (U8.B8)
B1_DAT23: Cart (J18.87), FPGA Cart (U8.A9)
B1_DAT24: Cart (J18.89), FPGA Cart (U8.B9)
B1_DAT25: Cart (J18.91), FPGA Cart (U8.A10)
B1_DAT26: Cart (J18.93), FPGA Cart (U8.A11)
B2_CLK0_N: Cart (J18.28), FPGA Cart (U8.J5)
B2_CLK0_P: Cart (J18.26), FPGA Cart (U8.G1)
B2_CLK1_N: Cart (J18.32), FPGA Cart (U8.J3)
B2_CLK1_P: Cart (J18.30), FPGA Cart (U8.H1)
B2_DAT0_N: Cart (J18.36), FPGA Cart (U8.N4)
B2_DAT0_P: Cart (J18.34), FPGA Cart (U8.R1)
B2_DAT1_N: Cart (J18.40), FPGA Cart (U8.L4)
B2_DAT1_P: Cart (J18.38), FPGA Cart (U8.L1)
B2_DAT2_N: Cart (J18.52), FPGA Cart (U8.K4)
B2_DAT2_P: Cart (J18.50), FPGA Cart (U8.M1)
B2_DAT3_N: Cart (J18.56), FPGA Cart (U8.K1)
B2_DAT3_P: Cart (J18.54), FPGA Cart (U8.K3)
B2_DAT4_N: Cart (J18.60), FPGA Cart (U8.J1)
B2_DAT4_P: Cart (J18.58), FPGA Cart (U8.J2)
B2_DAT5_N: Cart (J18.64), FPGA Cart (U8.H2)
B2_DAT5_P: Cart (J18.62), FPGA Cart (U8.J4)
B2_DAT6_N: Cart (J18.68), FPGA Cart (U8.C2)
B2_DAT6_P: Cart (J18.66), FPGA Cart (U8.C1)
B2_DAT7_N: Cart (J18.72), FPGA Cart (U8.D2)
B2_DAT7_P: Cart (J18.70), FPGA Cart (U8.F4)
B2_DAT8_N: Cart (J18.76), FPGA Cart (U8.G5)
B2_DAT8_P: Cart (J18.74), FPGA Cart (U8.D1)
B2_DAT9_N: Cart (J18.80), FPGA Cart (U8.F3)
B2_DAT9_P: Cart (J18.78), FPGA Cart (U8.G3)
B2_DAT10_N: Cart (J18.84), FPGA Cart (U8.H3)
B2_DAT10_P: Cart (J18.82), FPGA Cart (U8.F2)
B2_DAT11_N: Cart (J18.88), FPGA Cart (U8.E4)
B2_DAT11_P: Cart (J18.86), FPGA Cart (U8.B2)
B2_DAT12_N: Cart (J18.92), FPGA Cart (U8.H5)
B2_DAT12_P: Cart (J18.90), FPGA Cart (U8.E2)
BAT_SCL: Block Diagram (T4.1), Battery Manager (U1.17), USB Type C (J7.4 R59.2 U14.47)
BAT_SDA: Block Diagram (T5.1), Battery Manager (U1.16), USB Type C (J7.3 R58.2 U14.46)
BT_EN: SOM (U2.H15), WIFI Bluetooth (R75.1 U6.41)
BTN_LB: SOM (U2.R7), User Interface (C92.2 R65.1)
BTN_RB: SOM (U2.B3), User Interface (C93.2 R66.1)
C_CC1: USB Type C (C97.2 R116.2 U14.13), USB Type C Connector ESD (U30.12)
C_CC2: USB Type C (C28.2 R120.2 U14.15), USB Type C Connector ESD (U30.11)
C_USB_B_N: USB Type C (U14.9), USB Type C Connector ESD (J12.B7 U30.16)
C_USB_B_P: USB Type C (U14.8), USB Type C Connector ESD (J12.B6 U30.17)
C_USB_T_N: USB Type C (U14.7), USB Type C Connector ESD (J12.A7 U30.19)
C_USB_T_P: USB Type C (U14.6), USB Type C Connector ESD (J12.A6 U30.20)
CART_DET_N: SOM (U2.A3), Cart (J18.25 R44.1)
CART_INT_N: Cart (J18.27 R200.1), FPGA Cart (U8.F9)
FPGA_DONE_N: SOM (U2.B1), FPGA Config GPMC (Q11.1 R95.2 U8.M10)
FPGA_INT_N: SOM (U2.A4), FPGA Config GPMC (R201.2 U8.R5)
FPGA_RST_N: SOM (U2.T14), FPGA Config GPMC (R96.2 T2.1 U8.N11)
GPIO_INT_N: SOM (U2.T12), User Interface (R69.2 U5.10)
GPMC_AD0: SOM (U2.R3), FPGA Config GPMC (U8.T6)
GPMC_AD1: SOM (U2.R2), FPGA Config GPMC (U8.P9)
GPMC_AD2: SOM (U2.R1), FPGA Config GPMC (U8.R10)
GPMC_AD3: SOM (U2.T3), FPGA Config GPMC (U8.R4)
GPMC_AD4: SOM (U2.T2), FPGA Config GPMC (U8.P10)
GPMC_AD5: SOM (U2.T1), FPGA Config GPMC (U8.T3)
GPMC_AD6: SOM (U2.P4), FPGA Config GPMC (U8.T10)
GPMC_AD7: SOM (U2.R4), FPGA Config GPMC (U8.T11)
GPMC_AD8: SOM (U2.T4), FPGA Config GPMC (U8.T15)
GPMC_AD9: SOM (U2.P5), FPGA Config GPMC (U8.T14)
GPMC_AD10: SOM (U2.R5), FPGA Config GPMC (U8.T9)
GPMC_AD11: SOM (U2.T5), FPGA Config GPMC (U8.T13)
GPMC_AD12: SOM (U2.P6), FPGA Config GPMC (U8.T5)
GPMC_AD13: SOM (U2.R6), FPGA Config GPMC (U8.T8)
GPMC_AD14: SOM (U2.T6), FPGA Config GPMC (U8.T16)
GPMC_AD15: SOM (U2.P7), FPGA Config GPMC (U8.T7)
GPMC_ADVN_ALE: SOM (U2.M1), FPGA Config GPMC (U8.P6)
GPMC_BEN0_CLE: SOM (U2.N3), FPGA Config GPMC (U8.T2)
GPMC_BEN1: SOM (U2.N14), FPGA Config GPMC (U8.R16)
GPMC_CLK: SOM (U2.T7), FPGA Config GPMC (U8.R9)
GPMC_CSN0: SOM (U2.P3), FPGA Config GPMC (U8.R2)
GPMC_CSN1: SOM (U2.P2), FPGA Config GPMC (U8.P8)
GPMC_CSN2: SOM (U2.P1), FPGA Config GPMC (U8.N9)
GPMC_OEN_REN: SOM (U2.N1), FPGA Config GPMC (U8.R3)
GPMC_WAIT0: SOM (U2.P15), FPGA Config GPMC (U8.T1)
GPMC_WEN: SOM (U2.N2), FPGA Config GPMC (U8.P5)
GPMC_WPN: SOM (U2.R16), FPGA Config GPMC (U8.P4)
HP_DETECT_N: User Interface (U5.8), Audio Codec (J19.4 R130.2)
I2C0_SCL: Block Diagram (J8.2), SOM Power (R50.2 U2.C10 U2.D10), User Interface (U5.26), Cart (J18.17)
I2C0_SDA: Block Diagram (J8.1), SOM Power (R49.2 U2.C11 U2.D11), User Interface (U5.25), Cart (J18.19)
I2C1_SCL: Block Diagram (T4.2), SOM (R56.2 U2.B11), LCD (R124.1), Audio Codec (U15.9), Power Main Regulators (U9.43)
I2C1_SDA: Block Diagram (T5.2), SOM (R57.2 U2.A11), LCD (R125.1), Audio Codec (U15.10), Power Main Regulators (U9.42)
I2C_PWR_ALERT: SOM (U2.P12), Power Main Regulators (U9.41)
I2C_USB_IRQ_N: USB Type C (R150.2 U14.43), User Interface (U5.16)
LCD_AC_BIAS_EN: SOM (U2.E1), LCD (R177.1)
LCD_DATA0: SOM (R5.1 U2.G3), LCD (R93.1)
LCD_DATA1: SOM (R4.1 U2.G2), LCD (R94.1)
LCD_DATA2: SOM (R3.1 U2.G1), LCD (R128.1)
LCD_DATA3: SOM (R16.1 U2.H3), LCD (R141.1)
LCD_DATA4: SOM (R2.1 U2.H2), LCD (R142.1)
LCD_DATA5: SOM (R15.1 U2.H1), LCD (R143.1)
LCD_DATA6: SOM (R14.1 U2.J3), LCD (R144.1)
LCD_DATA7: SOM (R13.1 U2.J2), LCD (R145.1)
LCD_DATA8: SOM (R12.1 U2.J1), LCD (R146.1)
LCD_DATA9: SOM (R11.1 U2.K3), LCD (R151.1)
LCD_DATA10: SOM (R10.1 U2.K2), LCD (R152.1)
LCD_DATA11: SOM (R9.1 U2.K1), LCD (R163.1)
LCD_DATA12: SOM (R8.1 U2.L3), LCD (R173.1)
LCD_DATA13: SOM (R7.1 U2.L2), LCD (R174.1)
LCD_DATA14: SOM (R1.1 U2.L1), LCD (R175.1)
LCD_DATA15: SOM (R6.1 U2.M3), LCD (R176.1)
LCD_ENABLE: SOM (U2.C12), LCD (R123.1)
LCD_HSYNC: SOM (U2.F2), LCD (R179.1)
LCD_PCLK: SOM (U2.F1), LCD (R180.1)
LCD_VSYNC: SOM (U2.F3), LCD (R178.1)
LED0: SOM (U2.B10), User Interface (Q12.1 R129.1)
LED1: SOM (U2.A10), User Interface (Q13.1 R170.1)
LED_BACKLIGHT_PWM: SOM (U2.C5), LCD (R106.1 U13.4)
MCASP0_ACLKX: SOM (U2.A1), Audio Codec (U15.14)
MCASP0_AHCLKX: SOM (U2.C4), Audio Codec (U15.15)
MCASP0_AXR0: SOM (U2.B2), Audio Codec (U15.11)
MCASP0_AXR1: SOM (U2.C3), Audio Codec (U15.12)
MCASP0_FSX: SOM (U2.A2), Audio Codec (U15.13)
MMC0_CD: SOM (U2.C14), SDCard (J5.10 R103.2)
MMC0_CLK: SOM (U2.B15), SDCard (J5.5 R102.2)
MMC0_CMD: SOM (U2.B16), SDCard (J5.3 R101.2)
MMC0_DAT0: SOM (U2.A16), SDCard (J5.7 R97.2)
MMC0_DAT1: SOM (U2.A15), SDCard (J5.8 R98.2)
MMC0_DAT2: SOM (U2.C16), SDCard (J5.1 R99.2)
MMC0_DAT3: SOM (U2.C15), SDCard (J5.2 R100.2)
MMC2_CLK: SOM (U2.D16), WIFI Bluetooth (R84.2 R86.1)
MMC2_CMD: SOM (U2.G14), WIFI Bluetooth (R83.2 R87.1)
MMC2_DAT0: SOM (U2.F16), WIFI Bluetooth (R82.2 R88.1)
MMC2_DAT1: SOM (U2.G15), WIFI Bluetooth (R81.2 R89.1)
MMC2_DAT2: SOM (U2.G16), WIFI Bluetooth (R80.2 R90.1)
MMC2_DAT3: SOM (U2.F15), WIFI Bluetooth (R79.2 R91.1)
PWR_ON: Block Diagram (S15.1), Power Main Regulators (U9.23)
S_SBU_N: USB Type C (R158.2 R162.1 U14.11), USB Type C Connector ESD (U30.14)
S_SBU_P: USB Type C (R157.2 R161.1 U14.10), USB Type C Connector ESD (U30.15)
SDRAM_ADDR0: FPGA SDRAM (U8.K15), SDRAM (U12.H7)
SDRAM_ADDR1: FPGA SDRAM (U8.M16), SDRAM (U12.H8)
SDRAM_ADDR2: FPGA SDRAM (U8.L16), SDRAM (U12.J8)
SDRAM_ADDR3: FPGA SDRAM (U8.K16), SDRAM (U12.J7)
SDRAM_ADDR4: FPGA SDRAM (U8.F16), SDRAM (U12.J3)
SDRAM_ADDR5: FPGA SDRAM (U8.F14), SDRAM (U12.J2)
SDRAM_ADDR6: FPGA SDRAM (U8.G16), SDRAM (U12.H3)
SDRAM_ADDR7: FPGA SDRAM (U8.F15), SDRAM (U12.H2)
SDRAM_ADDR8: FPGA SDRAM (U8.F12), SDRAM (U12.H1)
SDRAM_ADDR9: FPGA SDRAM (U8.H16), SDRAM (U12.G3)
SDRAM_ADDR10: FPGA SDRAM (U8.M15), SDRAM (U12.H9)
SDRAM_ADDR11: FPGA SDRAM (U8.F13), SDRAM (U12.G2)
SDRAM_ADDR12: FPGA SDRAM (U8.D16), SDRAM (U12.G1)
SDRAM_BANK0: FPGA SDRAM (U8.J15), SDRAM (U12.G7)
SDRAM_BANK1: FPGA SDRAM (U8.J14), SDRAM (U12.G8)
SDRAM_CAS_N: FPGA SDRAM (U8.J16), SDRAM (U12.F7)
SDRAM_CLK: FPGA SDRAM (U8.H11), SDRAM (U12.F2)
SDRAM_CLK_EN: FPGA SDRAM (U8.H14), SDRAM (U12.F3)
SDRAM_CS_N: FPGA SDRAM (U8.L14), SDRAM (U12.G9)
SDRAM_D0: FPGA SDRAM (U8.R14), SDRAM (U12.A8)
SDRAM_D1: FPGA SDRAM (U8.R15), SDRAM (U12.B9)
SDRAM_D2: FPGA SDRAM (U8.P14), SDRAM (U12.B8)
SDRAM_D3: FPGA SDRAM (U8.P15), SDRAM (U12.C9)
SDRAM_D4: FPGA SDRAM (U8.G13), SDRAM (U12.C8)
SDRAM_D5: FPGA SDRAM (U8.P16), SDRAM (U12.D9)
SDRAM_D6: FPGA SDRAM (U8.K14), SDRAM (U12.D8)
SDRAM_D7: FPGA SDRAM (U8.N16), SDRAM (U12.E9)
SDRAM_D8: FPGA SDRAM (U8.E14), SDRAM (U12.E1)
SDRAM_D9: FPGA SDRAM (U8.D15), SDRAM (U12.D2)
SDRAM_D10: FPGA SDRAM (U8.E13), SDRAM (U12.D1)
SDRAM_D11: FPGA SDRAM (U8.D14), SDRAM (U12.C2)
SDRAM_D12: FPGA SDRAM (U8.C16), SDRAM (U12.C1)
SDRAM_D13: FPGA SDRAM (U8.G15), SDRAM (U12.B2)
SDRAM_D14: FPGA SDRAM (U8.B16), SDRAM (U12.B1)
SDRAM_D15: FPGA SDRAM (U8.G14), SDRAM (U12.A2)
SDRAM_DM_H: FPGA SDRAM (U8.E16), SDRAM (U12.F1)
SDRAM_DM_L: FPGA SDRAM (U8.H13), SDRAM (U12.E8)
SDRAM_RAS_N: FPGA SDRAM (U8.J13), SDRAM (U12.F8)
SDRAM_WE_N: FPGA SDRAM (U8.M14), SDRAM (U12.F9)
SPI0_CS0: SOM (U2.A14), FPGA Config GPMC (T10.1)
SPI0_MISO: SOM (U2.B13), FPGA Config GPMC (T8.1)
SPI0_MOSI: SOM (U2.B14), FPGA Config GPMC (T9.1)
SPI0_SCLK: SOM (U2.A13), FPGA Config GPMC (T7.1)
TOUCH_INT_N: User Interface (U5.22), LCD (R127.1)
TOUCH_PAD_INT: Block Diagram (J8.6), SOM (U2.T13)
TOUCH_PAD_RST_N: Block Diagram (J8.5), SOM (U2.R12)
TOUCH_RESET_N: SOM (U2.R14), LCD (R126.1)
UART0_RX: SOM (U2.A12), Low Speed Expansion (J20.4)
UART0_TX: SOM (U2.B12), Low Speed Expansion (J20.5)
UART3_CTSN: SOM (U2.E13), WIFI Bluetooth (R72.1 R77.2)
UART3_RTSN: SOM (U2.D13), WIFI Bluetooth (R73.1 R78.2)
UART3_RXD: SOM (U2.D14), WIFI Bluetooth (R71.1)
UART3_TXD: SOM (U2.D15), WIFI Bluetooth (R70.1)
USB_2P0_N: USB Type C (U14.5), SOM Analog USB (U2.L16)
USB_2P0_P: USB Type C (U14.4), SOM Analog USB (U2.L15)
USB_OTG_ID: USB Type C (R136.1 R137.2), SOM Analog USB (U2.L14)
VOLUME: SOM Analog USB (U2.C7), Audio Codec (S2.2)
WIFI_IRQ: SOM (U2.H14), WIFI Bluetooth (R85.2 R92.1)
WLAN_EN: SOM (U2.H16), WIFI Bluetooth (R76.1 U6.40)

## Assembly variants
Main Build: not fitted J1 J4 J6 J7 J9 J13 J18 J28 L2 L3 L5 L6 R52 R56 R57 R104 R105 R136 S2